# EAGLE design stock (EAGLE 7.5.0)
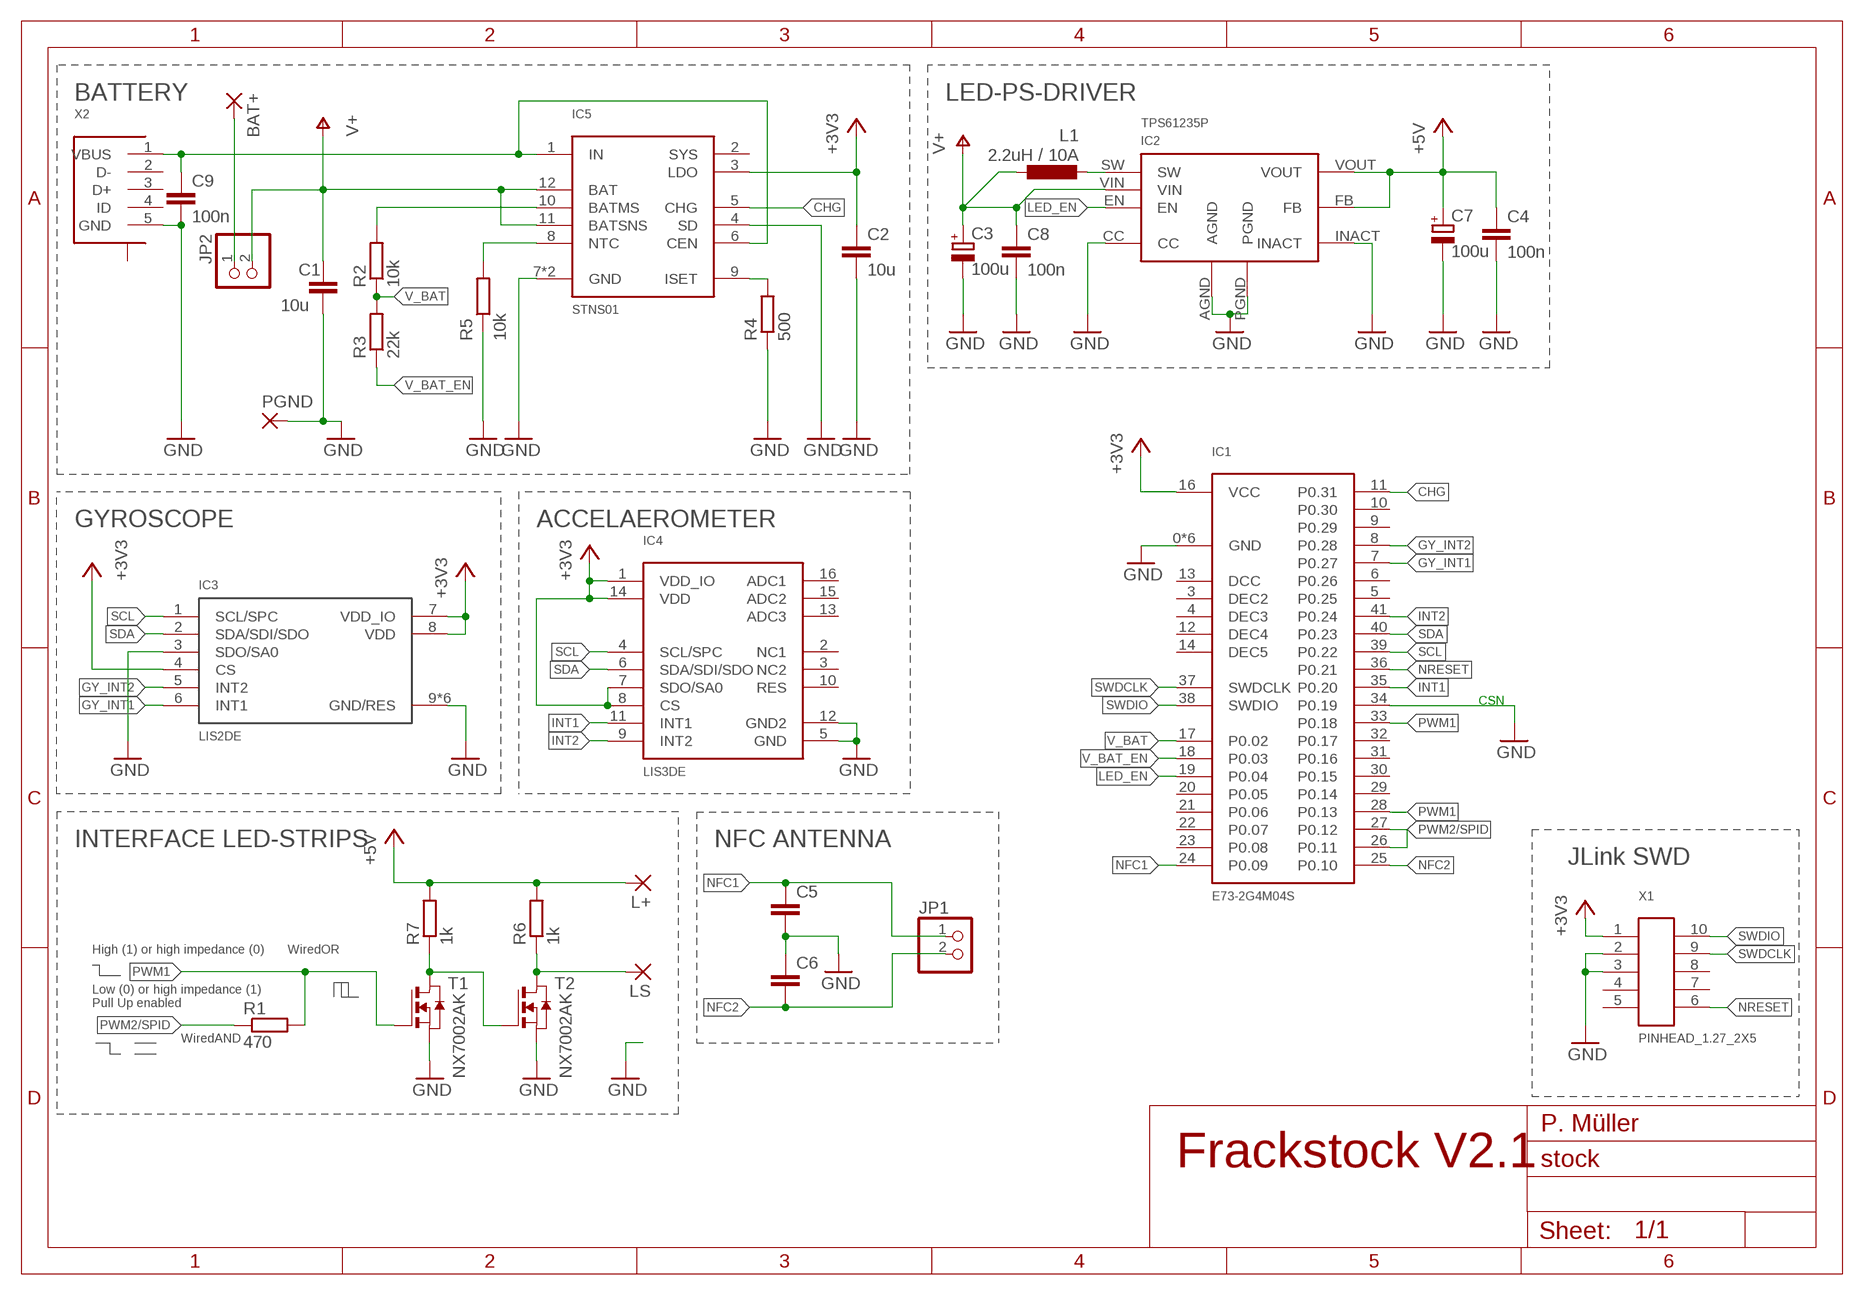
[diagram p0: schematic, sheet 1]

## Parts
BAT+  SMD2  [SMD1,27-2,54]
C1  10u  C-EUC0805  [C0805]
C2  10u  C-EUC0805  [C0805]
C3  100u  CPOL-EUSMCD  [SMC_D]
C4  100n  C-EUC0805  [C0805]
C5  C-EUC0805  [C0805]
C6  C-EUC0805  [C0805]
C7  100u  CPOL-EUSMCD  [SMC_D]
C8  100n  C-EUC0805  [C0805]
C9  100n  C-EUC0805  [C0805]
IC1  E73-2G4M04S  [E73-2G4M04S]
IC2  TPS61235P  [TPS6823]
IC3  LIS2DE  [LGA-14]
IC4  LIS3DE  [LGA-16]
IC5  STNS01  [DFN12]
JP1  PINHD-1X2  [1X02]
JP2  PINHD-1X2  [1X02]
L1  2.2uH / 10A  L-EUL5650M  [L5650M]
L+  SMD2  [SMD1,27-2,54]
LS  SMD2  [SMD1,27-2,54]
PGND  SMD5  [SMD2,54-5,08]
R1  470  R-EU_R0603  [R0603]
R2  10k  R-EU_R0603  [R0603]
R3  22k  R-EU_R0603  [R0603]
R4  500  R-EU_R0603  [R0603]
R5  10k  R-EU_R0603  [R0603]
R6  1k  R-EU_R0603  [R0603]
R7  1k  R-EU_R0603  [R0603]
T1  NX7002AK  NMOSSOT23  [SOT-23]
T2  NX7002AK  NMOSSOT23  [SOT-23]
X1  PINHEAD_1.27_2X5  [PINHEAD_2X5]
X2  USB_MICRO_SENKRECHT  [USB_MOLEX_SENKRECHT]

## Nets
+3V3: C2.1 IC1.16(VCC) IC3.4(CS) IC3.7(VDD_IO) IC3.8(VDD) IC4.1(VDD_IO) IC4.7(SDO/SA0) IC4.8(CS) IC4.14(VDD) IC5.3(LDO) X1.1
+5V: C4.1 C7.+ IC2.FB IC2.VOUT L+.1(P) R6.2 R7.2
CEN: C9.1 IC5.1(IN) IC5.6(CEN) X2.1(VBUS)
CHG: IC1.11(P0.31) IC5.5(CHG)
GND: C1.2 C2.2 C3.- C4.2 C5.2 C6.1 C7.- C8.2 C9.2 IC1.0(GND) IC1.1(GND) IC1.2(GND) IC1.15(GND) IC1.34(P0.19) IC1.42(GND) IC1.43(GND) IC2.AGND IC2.CC IC2.INACT IC2.PGND IC3.3(SDO/SA0) IC3.9(GND/RES) IC3.10(GND/RES) IC3.11(GND/RES) IC3.12(GND/RES) IC3.13(GND/RES) IC3.14(GND/RES) IC4.5(GND) IC4.12(GND2) IC5.4(SD) IC5.7(GND) IC5.EXP(GND) PGND.1(P) R4.1 R5.1 T1.2(S) T2.2(S) X1.2 X1.3 X2.5(GND)
GY_INT1: IC1.7(P0.27) IC3.6(INT1)
GY_INT2: IC1.8(P0.28) IC3.5(INT2)
INT1: IC1.35(P0.20) IC4.11(INT1)
INT2: IC1.41(P0.24) IC4.9(INT2)
LED_EN: IC1.19(P0.04) IC2.EN
N$1: IC2.SW L1.2
N$2: R7.1 T1.1(D) T2.3(G)
N$3: LS.1(P) R6.1 T2.1(D)
N$4: BAT+.1(P) JP2.1
N$5: IC5.9(ISET) R4.2
N$6: IC5.8(NTC) R5.2
N$7: IC5.10(BATMS) R2.2
NFC1: C5.1 IC1.24(P0.09) JP1.1
NFC2: C6.2 IC1.25(P0.10) JP1.2
NRESET: IC1.36(P0.21) X1.6
PWM1: IC1.28(P0.13) IC1.33(P0.18) R1.2 T1.3(G)
PWM2/SPID: IC1.26(P0.11) IC1.27(P0.12) R1.1
SCL: IC1.39(P0.22) IC3.1(SCL/SPC) IC4.4(SCL/SPC)
SDA: IC1.40(P0.23) IC3.2(SDA/SDI/SDO) IC4.6(SDA/SDI/SDO)
SWDCLK: IC1.37(SWDCLK) X1.9
SWDIO: IC1.38(SWDIO) X1.10
V+: C1.1 C3.+ C8.1 IC2.VIN IC5.11(BATSNS) IC5.12(BAT) JP2.2 L1.1
V_BAT: IC1.17(P0.02) R2.1 R3.2
V_BAT_EN: IC1.18(P0.03) R3.1
Unconnected: IC1.3(DEC2) IC1.4(DEC3) IC1.5(P0.25) IC1.6(P0.26) IC1.9(P0.29) IC1.10(P0.30) IC1.12(DEC4) IC1.13(DCC) IC1.14(DEC5) IC1.20(P0.05) IC1.21(P0.06) IC1.22(P0.07) IC1.23(P0.08) IC1.29(P0.14) IC1.30(P0.15) IC1.31(P0.16) IC1.32(P0.17) IC4.2(NC1) IC4.3(NC2) IC4.10(RES) IC4.13(ADC3) IC4.15(ADC2) IC4.16(ADC1) IC5.2(SYS) X1.4 X1.5 X1.7 X1.8 X2.2(D-) X2.3(D+) X2.4(ID) X2.C1(CASE) X2.C2(CASE) X2.C3(CASE) X2.C4(CASE)

## Notes on the sheet
- BATTERY | LED-PS-DRIVER
- GYROSCOPE | ACCELAEROMETER
- CSN
- INTERFACE LED-STRIPS | NFC ANTENNA
- JLink SWD
- High (1) or high impedance (0) | WiredOR
- Low (0) or high impedance (1)
  Pull Up enabled
- WiredAND
- P. Müller
- Frackstock V2.1

## Library data of the parts
BAT+ L+ LS = wirepad:SMD2: SMD PAD
C1 C2 C4-C6 C8 C9 = resistor:C-EU: CAPACITOR, European symbol
C3 C7 = resistor:CPOL-EU: POLARIZED CAPACITOR, European symbol
IC1 = stock_components:E73-2G4M04S: Webseite: http://www.cdebyte.com/en/product-view-news.aspx?id=243
IC2 = stock_components:TPS61235P
IC3 = stock_components:LIS2DE
IC4 = stock_components:LIS3DE
IC5 = stock_components:STNS01
JP1 JP2 = pinhead:PINHD-1X2: PIN HEADER
L1 = resistor:L-EU: INDUCTOR, European symbol
PGND = wirepad:SMD5: SMD PAD
R1-R7 = resistor:R-EU_: RESISTOR, European symbol
T1 T2 = zetex:NMOSSOT23: MOS FET; OC_FARNELL: unknown; OC_NEWARK: unknown
X1 = stock_components:PINHEAD_1.27_2X5: Mouser: 855-M50-3610542
X2 = stock_components:USB_MICRO_SENKRECHT: Mouser: 538-105133-0001

## Board
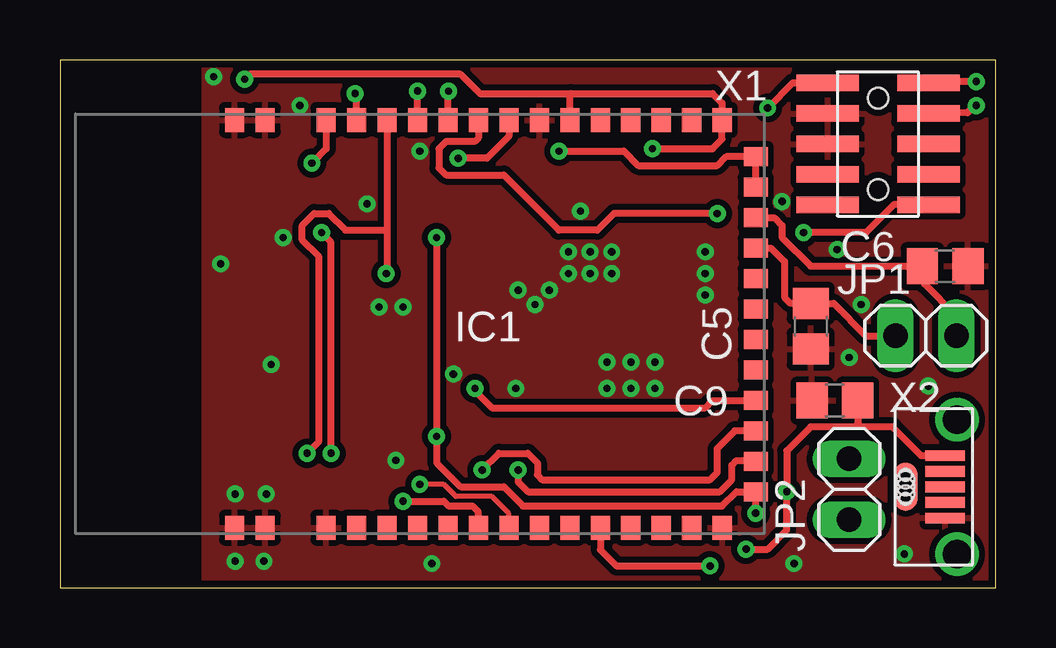
[diagram p1: board, top side]
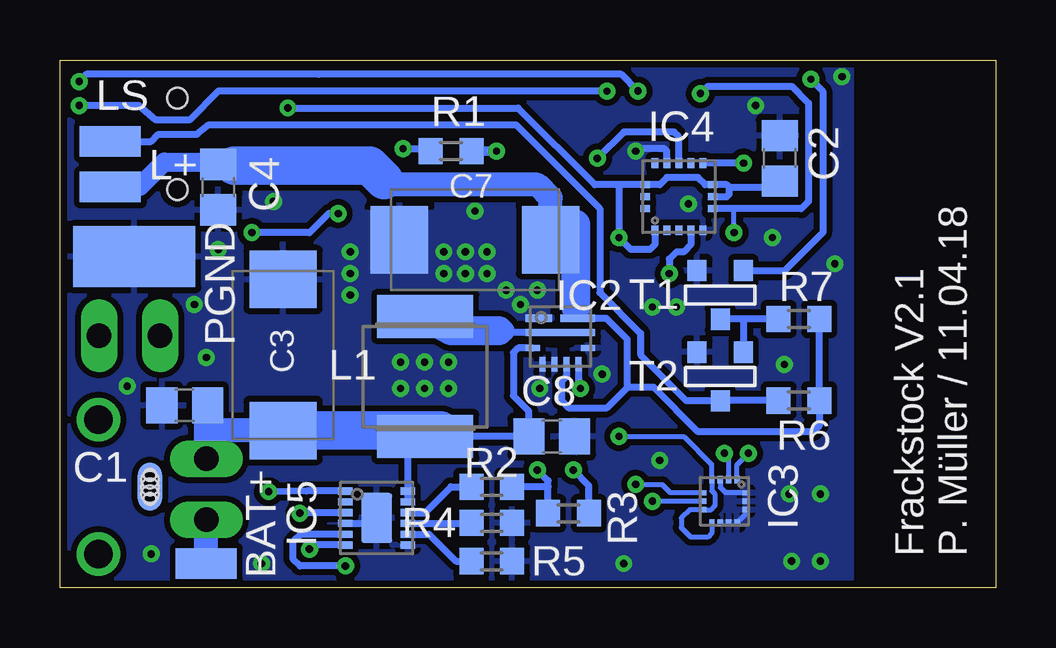
[diagram p2: board, bottom side, seen from below]

Size 39 x 22 mm. Coordinates in mm from the lower left corner, seen from the top.
Outline: 0,0 39,0 39,22 0,22 0,0
Copper layers (1*16): Top 0.035mm / dielectric 1.5mm / Bottom 0.035mm
Design rules "default *": minimum track width 0.1mm, minimum drill 0.2mm, track to track 0.1mm, track to pad 0.1mm, pad to pad 0.1mm, via to via 0.1mm, smd to smd 0.1mm, copper to edge 0.3mm, drill to drill 6mil, minimum pad ring 10mil, minimum via ring 8mil, stop-mask expansion 4mil, vias tented up to drill 0.4mm, thermal gap 10mil

### Footprints (pad centres in the part's own frame; a part is rotated, then mirrored left to right if it is on the bottom)
SMD1,27-2,54 = smd 1.27 x 2.54: 1 0,0
C0805 = smd 1.3 x 1.5: 1 -0.95,0; 2 0.95,0
SMC_D = smd 2.4 x 2.8: + -3.15,0; - 3.15,0
E73-2G4M04S = smd 0.8 x 1: 0 7.715,8.5; 1 6.445,8.5; 2 3.905,8.5; 3 2.635,8.5; 4 1.365,8.5; 5 0.095,8.5; 6 -1.175,8.5; 7 -2.445,8.5; 8 -3.715,8.5; 9 -4.985,8.5; 10 -6.255,8.5; 11 -7.525,8.5; 12 -8.795,8.5; 13 -10.065,8.5; 14 -11.335,8.5; 15 -12.605,8.5; 28 -12.605,-8.5; 29 -11.335,-8.5; 30 -10.065,-8.5; 31 -8.795,-8.5; 32 -7.525,-8.5; 33 -6.255,-8.5; 34 -4.985,-8.5; 35 -3.715,-8.5; 36 -2.445,-8.5; 37 -1.175,-8.5; 38 0.095,-8.5; 39 1.365,-8.5; 40 2.635,-8.5; 41 3.905,-8.5; 42 6.445,-8.5; 43 7.715,-8.5 | smd 1 x 0.8: 16 -14,7.005; 17 -14,5.735; 18 -14,4.465; 19 -14,3.195; 20 -14,1.925; 21 -14,0.655; 22 -14,-0.615; 23 -14,-1.885; 24 -14,-3.155; 25 -14,-4.425; 26 -14,-5.695; 27 -14,-6.965
TPS6823 = smd 0.25 x 0.6: AGND -0.25,-1.15; CC -0.75,-1.15; EN 0.75,-1.15; FB 0.25,-1.15 | smd 0.6 x 0.25: INACT 1.15,-0.475; VIN -1.15,-0.475 | smd 1.1 x 0.3: PGND -0.9,0.77 | smd 2.9 x 0.3: SW 0,0.17 | smd 1.45 x 0.3: VOUT 0.725,0.77
LGA-14 = smd 0.3 x 0.225: 1 -0.9,0.525; 2 -0.9,0.175; 3 -0.9,-0.175; 4 -0.9,-0.525; 8 0.9,-0.525; 9 0.9,-0.175; 10 0.9,0.175; 11 0.9,0.525 | smd 0.225 x 0.3: 5 -0.35,-0.9; 6 0,-0.9; 7 0.35,-0.9; 12 0.35,0.9; 13 0,0.9; 14 -0.35,0.9
LGA-16 = smd 0.4 x 0.3: 1 -1.4,1; 2 -1.4,0.5; 3 -1.4,0; 4 -1.4,-0.5; 5 -1.4,-1; 9 1.4,-1; 10 1.4,-0.5; 11 1.4,0; 12 1.4,0.5; 13 1.4,1 | smd 0.3 x 0.4: 6 -0.5,-1.4; 7 0,-1.4; 8 0.5,-1.4; 14 0.5,1.4; 15 0,1.4; 16 -0.5,1.4
DFN12 = smd 0.3 x 0.6: 1 -1.125,-1.3; 2 -0.675,-1.3; 3 -0.225,-1.3; 4 0.225,-1.3; 5 0.675,-1.3; 6 1.125,-1.3; 7 1.125,1.3; 8 0.675,1.3; 9 0.225,1.3; 10 -0.225,1.3; 11 -0.675,1.3; 12 -1.125,1.3 | smd 2.1 x 1.3: EXP 0,0
1X02 = drill 1.016 long: 1 -1.27,0; 2 1.27,0
L5650M = smd 1.8 x 4: 1 -2.5,0; 2 2.5,0
SMD2,54-5,08 = smd 2.54 x 5.08: 1 0,0
R0603 = smd 1 x 1.1: 1 -0.85,0; 2 0.85,0
SOT-23 = smd 0.787 x 0.889: 1 0.025,-1.016; 2 -0.94,1.016; 3 0.991,1.016
PINHEAD_2X5 = smd 0.7 x 2.6: 1 -2.54,-2.1; 2 -1.27,-2.1; 3 0,-2.1; 4 1.27,-2.1; 5 2.54,-2.1; 6 2.54,2.1; 7 1.27,2.1; 8 0,2.1; 9 -1.27,2.1; 10 -2.54,2.1 | hole 0.85: 1.905,0; -1.905,0
USB_MOLEX_SENKRECHT = smd 0.45 x 1.65: 1 -1.3,-0.5; 2 -0.65,-0.5; 3 0,-0.5; 4 0.65,-0.5; 5 1.3,-0.5 | drill 1.2: C1 -2.8,0; C2 2.8,0 | smd 2 x 1 bottom: C3 0,-2.15 | smd 2 x 1: C4 0,-2.15 | hole 0.5: -0.5,-2.15; 0.5,-2.15 | hole 0.7: 0,-2.15; 0.3,-2.15; -0.3,-2.15

### Placement (x,y rotation side)
BAT+  32.9,1 270 bottom
C1  33.8,7.6 180 bottom
C2  9,17.9 90 bottom
C3  29.7,9.7 90 bottom
C4  32.4,16.7 270 bottom
C5  31.3,10.9 270 top
C6  36.9,13.4 180 top
C7  21.7,14.5 180 bottom
C8  18.5,6.3 0 bottom
C9  32.3,7.8 180 top
IC1  15,11 180 top
IC2  18.14,10.46 0 bottom
IC3  11.3,3.6 270 bottom
IC4  13.2,16.3 90 bottom
IC5  25.8,2.9 270 bottom
JP1  36.1,10.5 0 top
JP2  32.9,4.1 90 top
L1  23.78,8.8 90 bottom
L+  36.9,16.7 270 bottom
LS  36.9,18.6 90 bottom
PGND  35.9,13.8 270 bottom
R1  22.7,18.2 180 bottom
R2  21,4.2 180 bottom
R3  17.8,3.1 180 bottom
R4  21,2.7 180 bottom
R5  21,1.1 180 bottom
R6  8.2,7.8 0 bottom
R7  8.2,11.2 0 bottom
T1  11.5,12.2 0 bottom
T2  11.5,8.8 0 bottom
X1  34.1,18.5 270 top
X2  37.4,4.2 270 top

### Tracks (layer width: path | path; a pad name or v marks a point on that pad's centre or on a via)
+3V3  (via drill 0.3)
  Top 0.3: v29,3.1 29,3.19 IC1.16 28.2,4 27.6,3.4 19.3,3.4 18.5,4.2 16.7,4.2 15.7,5.2 v15.7,6.3 v15.7,14.6 | X1.1 30.54,21.04 v29.5,20
  Bottom 0.2: IC3.8 11.82,2.27 12,2.1 12.7,2.1 13.1,2.5 13.1,2.9 12.75,3.25 IC3.7 11.85,3.25 11.7,3.4 11.7,3.9 11.82,4.03 IC3.4 11.82,5.12 13,6.3 v15.7,6.3
  Bottom 0.3: IC5.3 29.18,3.12 v29,3.1 | IC4.7 11.2,16.3 11.1,16.4 11.1,16.7 | 11.1,16.7 11.2,16.8 IC4.8 12.1,16.8 12.4,17.1 13.7,17.1 14,16.8 IC4.14 15.8,16.8 | 11.1,16.7 9.25,16.7 C2.1 | v29.5,20 19.9,20 16.7,16.8 15.8,16.8 | 15.8,16.8 15.7,16.7 v15.7,14.6 15.2,14.1 14.4,14.1 14.2,14.3 IC4.1
+5V
  Bottom 0.2: IC2.VOUT 17.41,11.38 17.4,11.4
  Bottom 0.3: IC2.FB 17.89,8.81 18.1,8.6 18.1,7.8 17.8,7.5 16.2,7.5 15.35,8.35 | IC2.VOUT 16.23,11.23 15.35,10.35 15.35,8.35 | R7.2 R6.2 7.35,6.75 7.6,6.5 12.4,6.5 14.25,8.35 15.35,8.35
  Bottom 0.4: 17.4,11.3 17.4,11.4
  Bottom 0.6: 17.4,11.4 17.4,11.5
  Bottom 0.8: 17.4,11.5 17.5,11.6 | L+.1 35.7,16.7 34.65,17.75 32.5,17.75 C4.1
  Bottom 1: 17.5,11.6 17.5,11.7 | C7.+ 18.55,16.25 19.1,16.8 25.3,16.8 25.5,17 | 31.75,17.6 C4.1
  Bottom 1.2: 17.5,11.7 17.5,15.15 C7.+
  Bottom 1.6: 31.75,17.6 26.1,17.6 25.5,17
CEN  (via drill 0.3)
  Top 0.3: v28.6,1.6 29.5,1.6 30.3,2.4 v30.3,4 30.3,5.7 31.3,6.7 33.3,6.7 | 33.3,6.7 34.7,6.7 35.9,5.5 X2.1 | C9.1 33.25,6.85 33.3,6.7
  Bottom 0.3: IC5.1 28.73,4.03 v30.3,4 | IC5.6 28.43,1.77 v28.6,1.6
CHG  (via drill 0.3)
  Top 0.3: IC1.11 22.52,1.57 23.2,0.9 v27.1,0.9
  Bottom 0.3: IC5.5 28.98,2.23 29.3,1.9 29.3,1.2 29,0.9 v27.1,0.9
GND  (via drill 0.3, 0.3 pad 0.6)
  Bottom 0.2: IC3.3 11.47,4.17 11.25,3.95 IC3.14 | IC3.12 10.4,3.08 IC3.11
  Bottom 0.3: IC5.4 26.23,2.67 IC5.EXP | IC4.12 13.7,18.2 13.8,18.3 14.7,18.3 v15,18.2
  other vias: 35.2,1.4 6.7,13.5 7.3,1.1 26.9,14 21.7,15.7 36.2,8.4 6.4,21.3 16.4,8.9 19,8.3 23.8,9.4 8.6,3.9 12.8,16 10,20.1 32.9,9.6 15.5,1 14,5.3 9.3,14.6 8.8,9.3 30.1,16.1 30.6,1 14.3,11.7 19.8,11.8 22.1,13.1 23,13.1 22.8,9.4 24.8,9.4 19.1,12.4 20.4,12.4 33.4,11.8 32.4,14.1 21.2,13.1 23,14 22.1,14 21.2,14 26.9,13.1 26.9,12.2 22.8,8.3 23.8,8.3 24.8,8.3 13.3,11.7 8.5,1.1 7.3,3.9
  pour Bottom (isolate 0.25): 39,22 39,0 6,0 6,22
  pour Top (isolate 0.25): 39,0 6,0 6,22 39,22
  pour Bottom (no thermals): 18.7,12.8 18.6,11.2 19.8,11.2 20.3,11.7 20.8,11.7 20.9,12.7 26.4,12.7 26.4,11.2 27.5,11.2 27.5,14.5 26.4,14.5 26.4,15.7 20.2,15.7 20.2,12.8
GY_INT1  (via drill 0.3)
  Top 0.3: v14.3,3.6 16,3.6 16.2,3.4 17.2,3.4 17.45,3.15 IC1.7
  Bottom 0.2: IC3.6 v14.3,3.6
GY_INT2  (via drill 0.3)
  Top 0.2: IC1.8 18.71,3.08 18,3.8 16.5,3.8 16,4.3 v15,4.3
  Bottom 0.2: v15,4.3 13.9,4.3 13.55,3.95 IC3.5
INT1  (via drill 0.3)
  Top 0.3: IC1.35 18.71,18.82 17.8,17.9 v16.6,17.9
  Bottom 0.3: IC4.11 13.2,18.8 13.4,19 15.5,19 v16.6,17.9
INT2  (via drill 0.3)
  Top 0.3: IC1.41 11.1,18.3 v10.5,17.7
  Bottom 0.3: v10.5,17.7 IC4.9
LED_EN  (via drill 0.3)
  Top 0.3: v17.3,8.3 17.3,8.2 18,7.5 26.9,7.5 27.2,7.8 IC1.19
  Bottom 0.3: IC2.EN 17.39,8.51 v17.3,8.3
N$1
  Bottom 0.3: IC2.SW 20.23,10.63 20.3,10.7
  Bottom 0.5: 20.3,10.7 20.5,10.7
  Bottom 0.9: 20.5,10.7 20.7,10.7
  Bottom 1.2: 20.7,10.7 22.68,10.7 L1.2
N$2
  Bottom 0.3: R7.1 10.5,11.2 | 10.5,11.2 11.47,11.2 T1.1 | T2.3 10.5,11.2
N$3
  Bottom 0.3: R6.1 11.47,7.8 T2.1 12.88,7.78 14.8,9.7 14.8,10.6 16.5,12.3 16.5,15.8 20,19.3 32.8,19.3 33.3,18.9 34.9,18.9 35.2,18.6 LS.1
N$4
  Bottom 1: BAT+.1 JP2.1
N$5
  Bottom 0.3: 22.1,2.6 R4.2 21.88,2.67 IC5.9
N$6
  Bottom 0.3: IC5.8 23.62,2.23 22.5,1.1 R5.2
N$7
  Bottom 0.3: R2.2 22.7,4.2 23.77,3.12 IC5.10
NFC1
  Top 0.3: IC1.24 29.64,14.15 30.2,13.6 30.2,12.1 30.45,11.85 C5.1 32.25,11.85 33.6,10.5 JP1.1
NFC2
  Top 0.3: IC1.25 29.77,15.43 30.1,15.1 30.1,14.6 31.3,13.4 C6.2 36.05,12.65 37.37,11.33 JP1.2
NRESET  (via drill 0.3)
  Top 0.3: IC1.36 17.45,18.75 17.3,18.6 16.1,18.6 15.8,18.3 15.8,17.5 16.1,17.2 18.5,17.2 20.8,14.9 22.4,14.9 23.1,15.6 v27.4,15.6 | X1.6 34.76,15.96 33.6,14.8 v31,14.8
  Bottom 0.3: v27.4,15.6 27.8,15.6 28.6,14.8 v31,14.8
PWM1  (via drill 0.3)
  Top 0.3: 21.3,20.6 17.5,20.6 16.7,21.4 7.9,21.4 v7.7,21.2 | 21.3,20.6 27.2,20.6 27.6,20.2 IC1.28 | v24.7,18.3 27.2,18.3 27.6,18.7 IC1.28 | IC1.33 21.25,20.55 21.3,20.6
  Top 0.4: IC1.28
  Top 0.5: IC1.28
  Bottom 0.3: v7.7,21.2 7.2,20.7 7.2,14.8 8.78,13.22 T1.3 | v24.7,18.3 23.65,18.3 R1.2
PWM2/SPID  (via drill 0.3)
  Top 0.3: IC1.26 IC1.27 27.77,17.96 27.4,17.6 24.1,17.6 23.5,18.2 v20.8,18.2
  Top 0.4: IC1.26
  Bottom 0.4: R1.1 v20.8,18.2
SCL  (via drill 0.3)
  Top 0.3: v10.3,5.6 10.8,6.1 10.8,13.8 10.1,14.5 10.1,15.1 10.6,15.6 11.2,15.6 11.9,14.9 13.54,14.9 13.63,15 | IC1.39 13.63,15 | 13.63,15 13.63,13.16 v13.6,13.1
  Bottom 0.2: IC3.1 10.78,5.12 v10.3,5.6
  Bottom 0.3: IC4.4 12.7,14.3 13,14 13.3,14 13.6,13.7 v13.6,13.1
SDA  (via drill 0.3)
  Top 0.3: v11.3,5.6 11.3,14.4 v10.9,14.8 | IC1.40 12.37,20.54 v12.3,20.6
  Bottom 0.2: IC3.2 11.12,5.42 v11.3,5.6 | v10.9,14.8 10.9,15.8
  Bottom 0.3: IC4.6 10.9,15.8 8.1,15.8 7.8,16.1 7.8,20.2 8.5,20.9 12,20.9 v12.3,20.6
SWDCLK  (via drill 0.3)
  Top 0.3: IC1.37 16.18,20.57 v16.2,20.7 | v38.2,20.1 37.83,19.8 X1.9
  Bottom 0.3: v16.2,20.7 32.4,20.7 33.6,19.5 35,19.5 35.7,20.1 v38.2,20.1
SWDIO  (via drill 0.3)
  Top 0.3: IC1.38 v14.9,20.7 | v38.2,21.1 36.26,21.1 X1.10
  Bottom 0.3: v14.9,20.7 15.6,21.41 28.2,21.4 37.9,21.4 v38.2,21.1
V+
  Bottom 0.3: IC5.11 IC5.12 24.5,6.55 | IC2.VIN 19.91,9.98 20.1,9.8 20.1,8 19.45,7.35 C8.1 L1.1
  Bottom 1: JP2.2 32.9,6.5 | 32.9,6.5 32.9,7.55 C1.1 | C3.+ 32.85,6.55 32.9,6.5
  Bottom 1.6: C3.+ 24.5,6.55 23.13,6.55 L1.1
V_BAT  (via drill 0.3)
  Top 0.3: v19.1,4.9 19.1,4.4 19.5,4 27.5,4 28,4.5 28,5.1 28.2,5.3 28.96,5.3 IC1.17
  Bottom 0.3: 18.65,4.2 R2.1 | R3.2 18.65,4.2 | 18.65,4.2 18.65,4.45 v19.1,4.9
V_BAT_EN  (via drill 0.3)
  Top 0.3: IC1.18 28.14,6.54 27.4,5.8 27.4,4.8 27.1,4.5 20.1,4.5 19.9,4.7 19.9,5.2 19.5,5.6 18.3,5.6 v17.6,4.9
  Bottom 0.3: R3.1 16.95,4.25 v17.6,4.9

### Text on the board
bPlace: Frackstock V2.1 / P. Müller / 11.04.18